# Altium schematic sheet 摄像头转换板_OV5647_MIPI V2.1.SchDoc
size A3
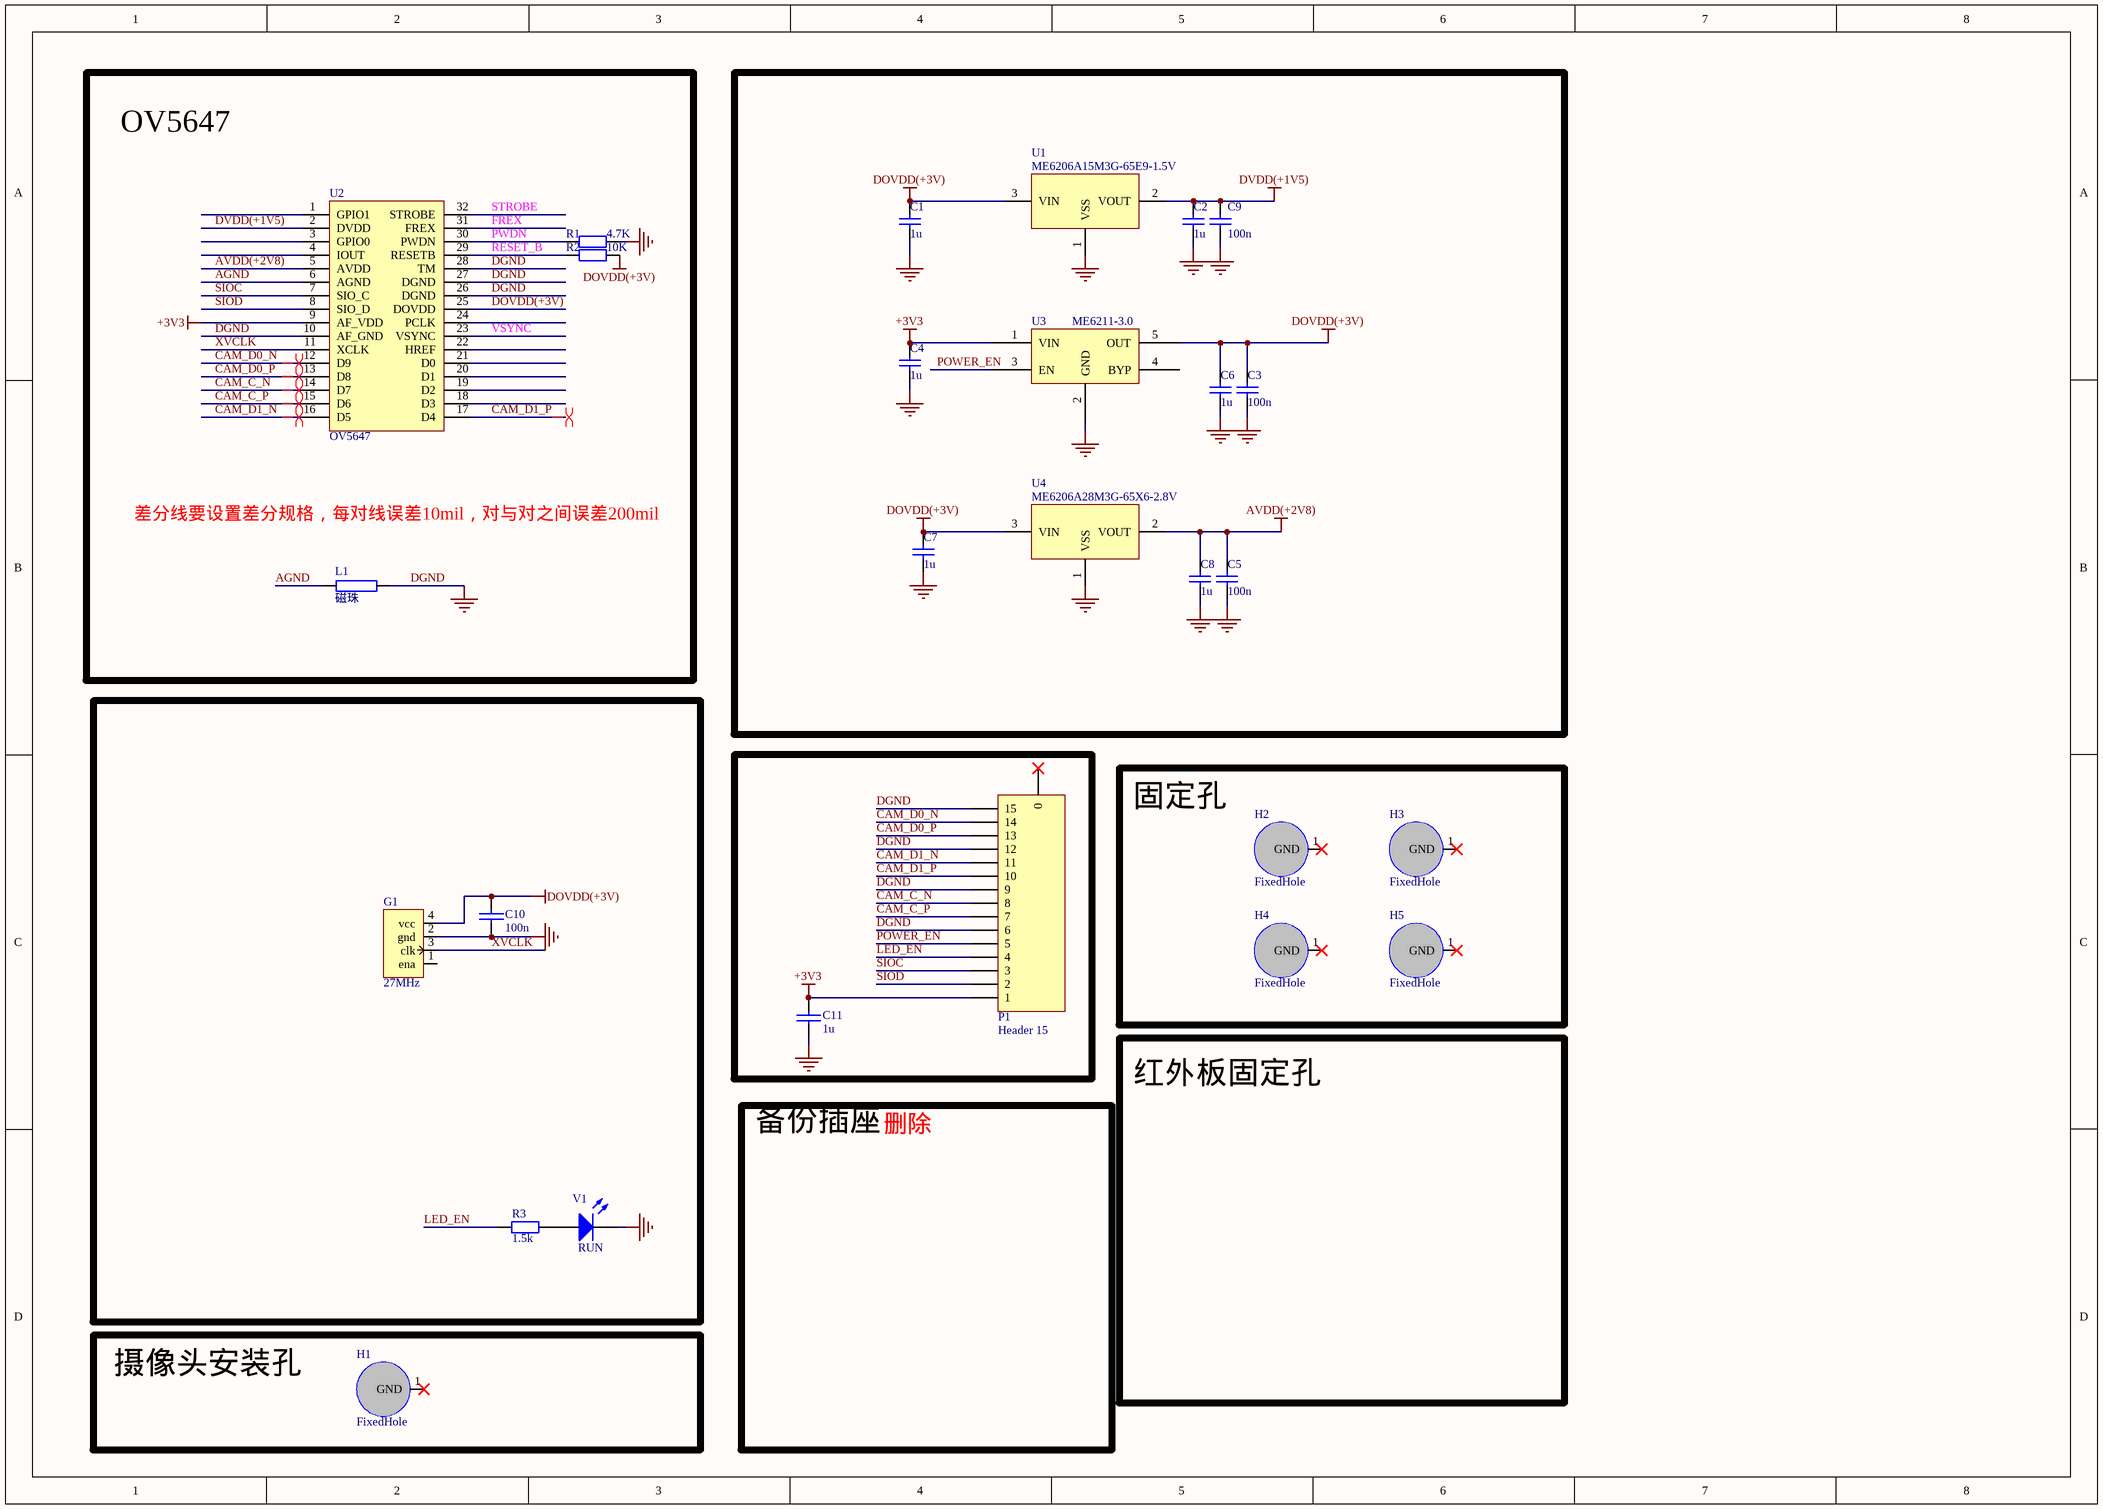
[diagram p0: 摄像头转换板_OV5647_MIPI V2.1.SchDoc]

## Parts
C1  1u  [0603S-CAP]
C2  1u  [0603S-CAP]
C3  100n  [0603S-CAP]
C4  1u  [0603S-CAP]
C5  100n  [0603S-CAP]
C6  1u  [0603S-CAP]
C7  1u  [0603S-CAP]
C8  1u  [0603S-CAP]
C9  100n  [0603S-CAP]
C10  100n  [0603S-CAP]
C11  1u  [0603S-CAP]
G1  27MHz  [爱普生晶振3.2×2.5mm]
H1  FixedHole  [摄像头安装孔_18/20]
H2  FixedHole  [固定孔]
H3  FixedHole  [固定孔]
H4  FixedHole  [固定孔]
H5  FixedHole  [固定孔]
L1  磁珠  [L0603]
P1  Header 15  [OV5647_MIPI]
R1  4.7K  [0603S-RES]
R2  10K  [0603S-RES]
R3  1.5k  [0603S-RES]
U1  ME6206A15M3G-65E9-1.5V  [SOT23-3]
U2  OV5647  [OV5647]
U3  ME6211-3.0  [SOT23-5]
U4  ME6206A28M3G-65X6-2.8V  [SOT23-3]
V1  RUN  [LED-0603]

## Blocks framed on the sheet
OV5647: L1 R1 R2 U2
固定孔: H2-H5
摄像头安装孔: H1

## Nets
+3V3: C4.2 C11.1 P1.1 U2.9(AF_VDD) U3.1(VIN)
AVDD(+2V8): C5.2 C8.2 U2.5(AVDD) U4.2(VOUT)
DGND: C1.1 C2.1 C3.1 C4.1 C5.1 C6.1 C7.1 C8.1 C9.1 C10.2 C11.2 G1.2(gnd) L1.1 P1.6 P1.9 P1.12 P1.15 R1.1 U1.1(VSS) U2.10(AF_GND) U2.26(DGND) U2.27(DGND) U2.28(TM) U3.2(GND) U4.1(VSS) V1.2(K)
DOVDD(+3V): C1.2 C3.2 C6.2 C7.2 C10.1 G1.4(vcc) R2.1 U1.3(VIN) U2.25(DOVDD) U3.5(OUT) U4.3(VIN)
DVDD(+1V5): C2.2 C9.2 U1.2(VOUT) U2.2(DVDD)
AGND: L1.2 U2.6(AGND)
CAM_C_N: P1.8 U2.14(D7)
CAM_C_P: P1.7 U2.15(D6)
CAM_D0_N: P1.14 U2.12(D9)
CAM_D0_P: P1.13 U2.13(D8)
CAM_D1_N: P1.11 U2.16(D5)
CAM_D1_P: P1.10 U2.17(D4)
FREX: U2.31(FREX)
LED_EN: P1.4 R3.1
POWER_EN: P1.5 U3.3(EN)
PWDN: R1.2 U2.30(PWDN)
RESET_B: R2.2 U2.29(RESETB)
SIOC: P1.3 U2.7(SIO_C)
SIOD: P1.2 U2.8(SIO_D)
STROBE: U2.32(STROBE)
VSYNC: U2.23(VSYNC)
XVCLK: G1.3(clk) U2.11(XCLK)
NetR3_2: R3.2 V1.1(A)

Not connected (* = marked no-connect by the designer): G1 1(ena); H1 1(GND)*; H2 1(GND)*; H3 1(GND)*; H4 1(GND)*; H5 1(GND)*; P1 0*; U2 1(GPIO1) 3(GPIO0) 4(IOUT) 18(D3) 19(D2) 20(D1) 21(D0) 22(HREF) 24(PCLK); U3 4(BYP)

## Layout directives
differential pair: CAM_C_N, CAM_C_P, CAM_D0_N, CAM_D0_P, CAM_D1_N, CAM_D1_P

## Notes on the sheet
- 差分线要设置差分规格，每对线误差10mil，对与对之间误差200mil
- 红外板固定孔
- 备份插座
- 删除

## Library data of the parts
C1 C2 C4 C6-C8 = Cap: 50V/8.2u/0805; Value: 100n; Published: 8-Jun-2000; LatestRevisionDate: 17-Jul-2002; LatestRevisionNote: Re-released for DXP Platform.; PackageReference: RAD-0.3; Publisher: Altium Limited
C3 C5 C9 = Cap: 50V/8.2u/0805; Published: 8-Jun-2000; LatestRevisionDate: 17-Jul-2002; LatestRevisionNote: Re-released for DXP Platform.; PackageReference: RAD-0.3; Publisher: Altium Limited; Value: 100n
C10 C11 = CAP: RC=1206
G1 = CTY4-B
H1-H5 = 固定孔
L1 = RES
P1 = Header 15: Header, 15-Pin; LatestRevisionDate: 17-Jul-2002; LatestRevisionNote: Re-released for DXP Platform.; Publisher: Altium Limited
R1-R3 = Res2: Resistor; Value: 49.9; Published: 8-Jun-2000; LatestRevisionDate: 17-Jul-2002; LatestRevisionNote: Re-released for DXP Platform.; PackageReference: AXIAL-0.4; Publisher: Altium Limited
U1 U4 = 65e9
U3 = PAM3101DAB150
V1 = LED0: Typical INFRARED GaAs LED; Published: 8-Jun-2000; LatestRevisionDate: 08-Jul-2005; LatestRevisionNote: Mech Layer 1 removed.; PackageReference: LED-0; Publisher: Altium Limited